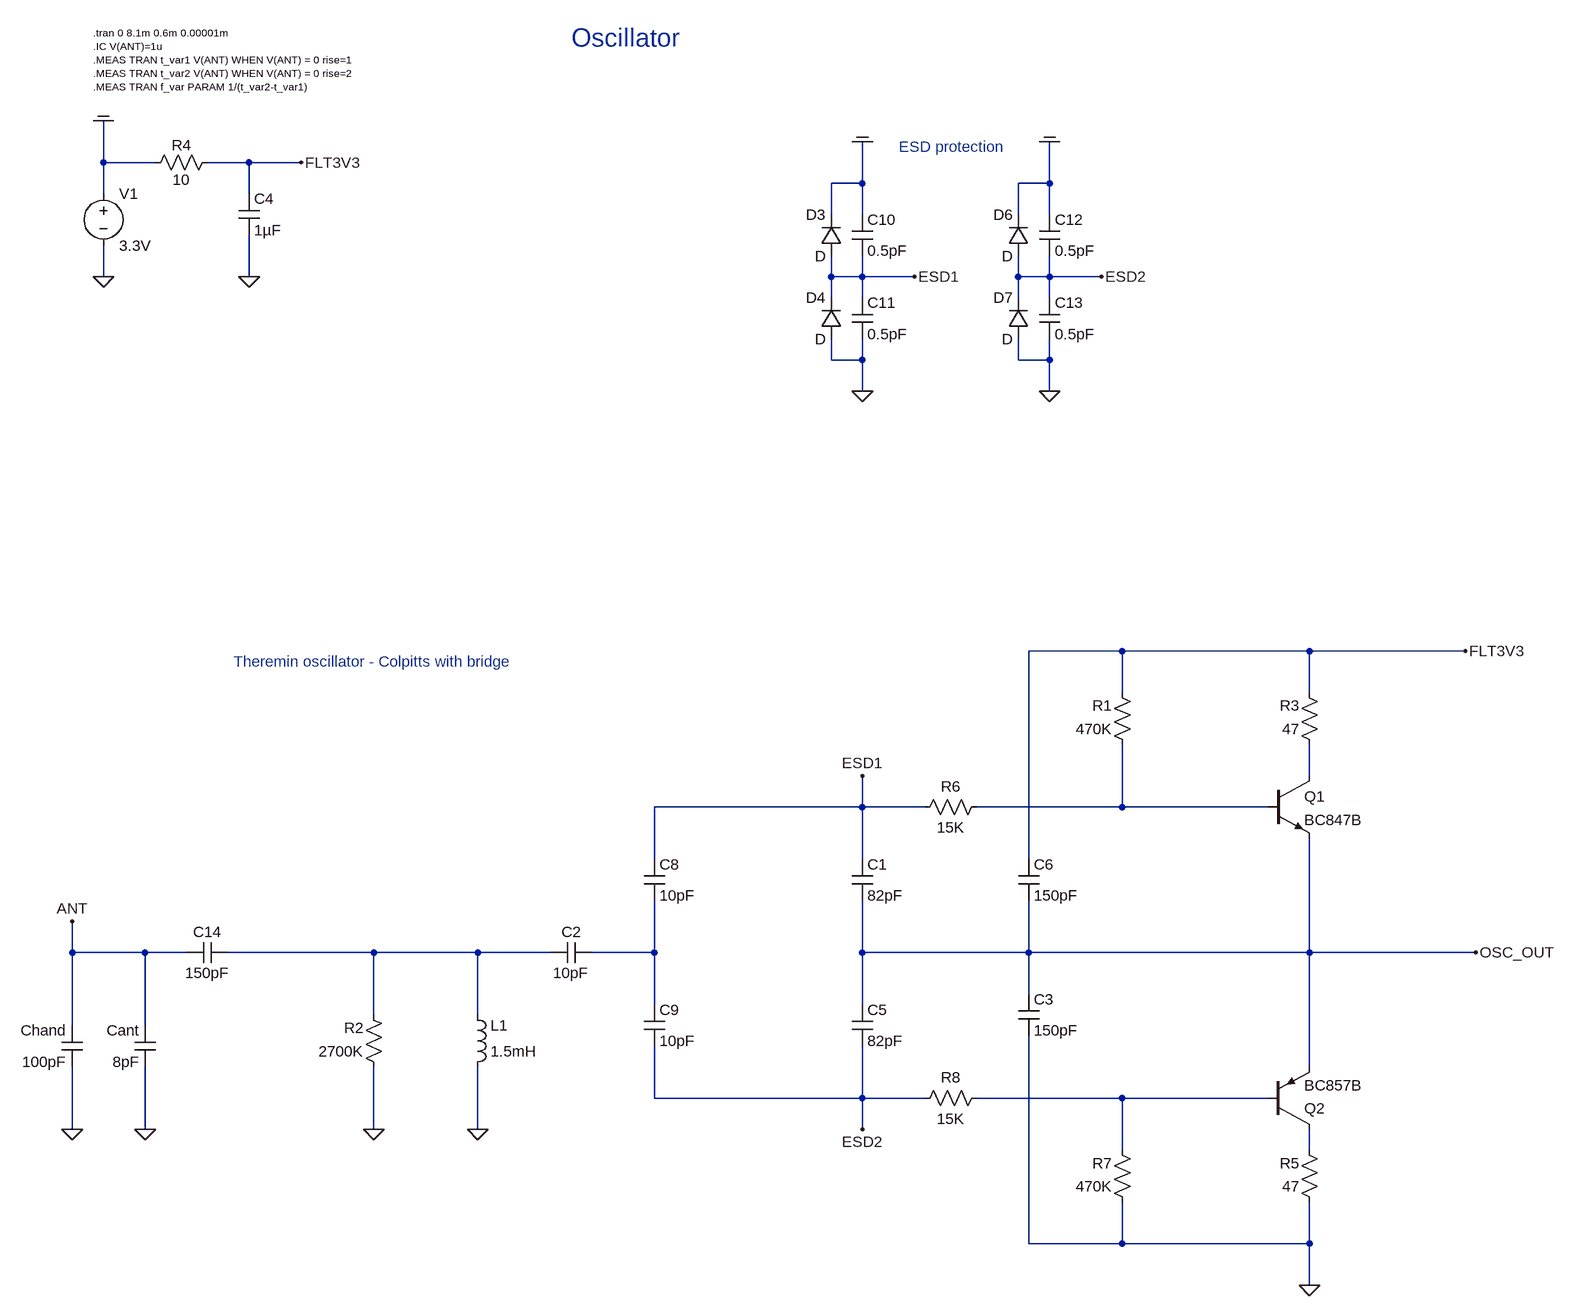
[diagram p0: schematic 2020_npn_pnp_osc_v16_tune_4.asc]
2020_npn_pnp_osc_v16_tune_4.asc, the LTspice schematic file:
Version 4
SHEET 1 2908 2724
WIRE -1056 -336 -1056 -400
WIRE -976 -336 -1056 -336
WIRE -832 -336 -896 -336
WIRE -752 -336 -832 -336
WIRE 112 -304 112 -368
WIRE 112 -304 64 -304
WIRE 400 -304 400 -368
WIRE 400 -304 352 -304
WIRE -1056 -288 -1056 -336
WIRE -832 -288 -832 -336
WIRE 64 -256 64 -304
WIRE 112 -256 112 -304
WIRE 352 -256 352 -304
WIRE 400 -256 400 -304
WIRE -1056 -160 -1056 -208
WIRE -832 -160 -832 -224
WIRE 64 -160 64 -192
WIRE 112 -160 112 -192
WIRE 112 -160 64 -160
WIRE 192 -160 112 -160
WIRE 352 -160 352 -192
WIRE 400 -160 400 -192
WIRE 400 -160 352 -160
WIRE 480 -160 400 -160
WIRE 64 -128 64 -160
WIRE 112 -128 112 -160
WIRE 352 -128 352 -160
WIRE 400 -128 400 -160
WIRE 64 -32 64 -64
WIRE 112 -32 112 -64
WIRE 112 -32 64 -32
WIRE 352 -32 352 -64
WIRE 400 -32 400 -64
WIRE 400 -32 352 -32
WIRE 112 16 112 -32
WIRE 400 16 400 -32
WIRE 512 416 368 416
WIRE 800 416 512 416
WIRE 1040 416 800 416
WIRE 512 480 512 416
WIRE 800 480 800 416
WIRE 800 608 800 560
WIRE 112 656 112 608
WIRE 112 656 -208 656
WIRE 208 656 112 656
WIRE 512 656 512 560
WIRE 512 656 288 656
WIRE 736 656 512 656
WIRE -208 736 -208 656
WIRE 112 736 112 656
WIRE 368 736 368 416
WIRE -1104 880 -1104 832
WIRE -992 880 -1104 880
WIRE -928 880 -992 880
WIRE -640 880 -864 880
WIRE -480 880 -640 880
WIRE -368 880 -480 880
WIRE -208 880 -208 800
WIRE -208 880 -304 880
WIRE 112 880 112 800
WIRE 368 880 368 800
WIRE 368 880 112 880
WIRE 800 880 800 704
WIRE 800 880 368 880
WIRE 1056 880 800 880
WIRE 368 944 368 880
WIRE -208 960 -208 880
WIRE 112 960 112 880
WIRE -640 976 -640 880
WIRE -480 976 -480 880
WIRE -1104 992 -1104 880
WIRE -992 992 -992 880
WIRE 800 1056 800 880
WIRE -208 1104 -208 1024
WIRE 112 1104 112 1024
WIRE 112 1104 -208 1104
WIRE 208 1104 112 1104
WIRE 512 1104 288 1104
WIRE 736 1104 512 1104
WIRE -1104 1152 -1104 1056
WIRE -992 1152 -992 1056
WIRE -640 1152 -640 1056
WIRE -480 1152 -480 1056
WIRE 112 1152 112 1104
WIRE 512 1184 512 1104
WIRE 800 1184 800 1152
WIRE 368 1328 368 1008
WIRE 512 1328 512 1264
WIRE 512 1328 368 1328
WIRE 800 1328 800 1264
WIRE 800 1328 512 1328
WIRE 800 1392 800 1328
FLAG -1056 -160 0
FLAG -1104 1152 0
FLAG -1104 832 ANT
FLAG -1056 -400 COM
FLAG 112 16 0
FLAG 112 -368 COM
FLAG 192 -160 ESD1
FLAG 400 16 0
FLAG 400 -368 COM
FLAG 480 -160 ESD2
FLAG -992 1152 0
FLAG 112 608 ESD1
FLAG -832 -160 0
FLAG -640 1152 0
FLAG -480 1152 0
FLAG -752 -336 FLT3V3
FLAG 1040 416 FLT3V3
FLAG 1056 880 OSC_OUT
FLAG 112 1152 ESD2
FLAG 800 1392 0
SYMBOL voltage -1056 -304 R0
WINDOW 123 0 0 Left 2
WINDOW 39 0 0 Left 2
SYMATTR InstName V1
SYMATTR Value 3.3V
SYMBOL ind -496 1072 M180
WINDOW 0 36 80 Left 2
WINDOW 3 36 40 Left 2
SYMATTR InstName L1
SYMATTR Value 1.5mH
SYMATTR SpiceLine Ipk=0.1 Rser=40 Rpar=20Meg Cpar=1.286pF
SYMBOL cap -1088 992 M0
SYMATTR InstName Chand
SYMATTR Value 100pF
SYMBOL diode 80 -192 R180
WINDOW 0 24 64 Left 2
WINDOW 3 24 0 Left 2
SYMATTR InstName D3
SYMBOL diode 80 -64 R180
WINDOW 0 24 64 Left 2
WINDOW 3 24 0 Left 2
SYMATTR InstName D4
SYMBOL cap 96 -256 R0
SYMATTR InstName C10
SYMATTR Value 0.5pF
SYMBOL cap 96 -128 R0
SYMATTR InstName C11
SYMATTR Value 0.5pF
SYMBOL diode 368 -192 R180
WINDOW 0 24 64 Left 2
WINDOW 3 24 0 Left 2
SYMATTR InstName D6
SYMBOL diode 368 -64 R180
WINDOW 0 24 64 Left 2
WINDOW 3 24 0 Left 2
SYMATTR InstName D7
SYMBOL cap 384 -256 R0
SYMATTR InstName C12
SYMATTR Value 0.5pF
SYMBOL cap 384 -128 R0
SYMATTR InstName C13
SYMATTR Value 0.5pF
SYMBOL cap -976 992 M0
SYMATTR InstName Cant
SYMATTR Value 8pF
SYMBOL res -880 -352 R90
WINDOW 0 5 56 VBottom 2
WINDOW 3 27 56 VTop 2
SYMATTR InstName R4
SYMATTR Value 10
SYMBOL cap -848 -288 R0
SYMATTR InstName C4
SYMATTR Value 1µF
SYMBOL res 528 576 R180
WINDOW 0 31 76 Left 2
WINDOW 3 31 40 Left 2
SYMATTR InstName R1
SYMATTR Value 470K
SYMBOL res -624 1072 R180
WINDOW 0 31 76 Left 2
WINDOW 3 31 40 Left 2
SYMATTR InstName R2
SYMATTR Value 2700K
SYMBOL cap 96 736 R0
SYMATTR InstName C1
SYMATTR Value 82pF
SYMBOL cap 352 944 R0
SYMATTR InstName C3
SYMATTR Value 150pF
SYMBOL npn 736 608 R0
SYMATTR InstName Q1
SYMATTR Value BC847B
SYMBOL pnp 736 1152 M180
SYMATTR InstName Q2
SYMATTR Value BC857B
SYMBOL res 528 1280 R180
WINDOW 0 31 76 Left 2
WINDOW 3 31 40 Left 2
SYMATTR InstName R7
SYMATTR Value 470K
SYMBOL cap 96 960 R0
SYMATTR InstName C5
SYMATTR Value 82pF
SYMBOL cap 352 736 R0
SYMATTR InstName C6
SYMATTR Value 150pF
SYMBOL cap -224 736 R0
SYMATTR InstName C8
SYMATTR Value 10pF
SYMBOL cap -224 960 R0
SYMATTR InstName C9
SYMATTR Value 10pF
SYMBOL res 816 576 R180
WINDOW 0 31 76 Left 2
WINDOW 3 31 40 Left 2
SYMATTR InstName R3
SYMATTR Value 47
SYMBOL res 816 1280 R180
WINDOW 0 31 76 Left 2
WINDOW 3 31 40 Left 2
SYMATTR InstName R5
SYMATTR Value 47
SYMBOL res 192 672 R270
WINDOW 0 32 56 VTop 2
WINDOW 3 0 56 VBottom 2
SYMATTR InstName R6
SYMATTR Value 15K
SYMBOL res 192 1120 R270
WINDOW 0 32 56 VTop 2
WINDOW 3 0 56 VBottom 2
SYMATTR InstName R8
SYMATTR Value 15K
SYMBOL cap -864 864 R90
WINDOW 0 0 32 VBottom 2
WINDOW 3 32 32 VTop 2
SYMATTR InstName C14
SYMATTR Value 150pF
SYMBOL cap -304 864 R90
WINDOW 0 0 32 VBottom 2
WINDOW 3 32 32 VTop 2
SYMATTR InstName C2
SYMATTR Value 10pF
TEXT -1072 -536 Left 1 !.tran 0 8.1m 0.6m 0.00001m\n.IC V(ANT)=1u\n.MEAS TRAN t_var1 V(ANT) WHEN V(ANT) = 0 rise=1\n.MEAS TRAN t_var2 V(ANT) WHEN V(ANT) = 0 rise=2\n.MEAS TRAN f_var PARAM 1/(t_var2-t_var1)
TEXT 168 -360 Left 2 ;ESD protection
TEXT -336 -528 Left 4 ;Oscillator
TEXT -856 432 Left 2 ;Theremin oscillator - Colpitts with bridge

The netlist it stands for:
* 2020_npn_pnp_osc_v16_tune_4.asc
V1 COM 0 3.3V
L1 0 N003 1.5mH Ipk=0.1 Rser=40 Rpar=20Meg Cpar=1.286pF
Chand ANT 0 100pF
D3 ESD1 COM D
D4 0 ESD1 D
C10 COM ESD1 0.5pF
C11 ESD1 0 0.5pF
D6 ESD2 COM D
D7 0 ESD2 D
C12 COM ESD2 0.5pF
C13 ESD2 0 0.5pF
Cant ANT 0 8pF
R4 FLT3V3 COM 10
C4 FLT3V3 0 1µF
R1 N002 FLT3V3 470K
R2 0 N003 2700K
C1 ESD1 OSC_OUT 82pF
C3 OSC_OUT 0 150pF
Q1 N001 N002 OSC_OUT 0 BC847B
Q2 N006 N005 OSC_OUT 0 BC857B
R7 0 N005 470K
C5 OSC_OUT ESD2 82pF
C6 FLT3V3 OSC_OUT 150pF
C8 ESD1 N004 10pF
C9 N004 ESD2 10pF
R3 N001 FLT3V3 47
R5 0 N006 47
R6 ESD1 N002 15K
R8 ESD2 N005 15K
C14 N003 ANT 150pF
C2 N004 N003 10pF
.model D D
.lib standard.dio
.model NPN NPN
.model PNP PNP
.lib standard.bjt
.tran 0 8.1m 0.6m 0.00001m
.IC V(ANT)=1u
.MEAS TRAN t_var1 V(ANT) WHEN V(ANT) = 0 rise=1
.MEAS TRAN t_var2 V(ANT) WHEN V(ANT) = 0 rise=2
.MEAS TRAN f_var PARAM 1/(t_var2-t_var1)
* ESD protection
* Oscillator
* Theremin oscillator - Colpitts with bridge
.backanno
.end